# Altium project motordriver-v5.1.PrjPcb (part 3 of 3)
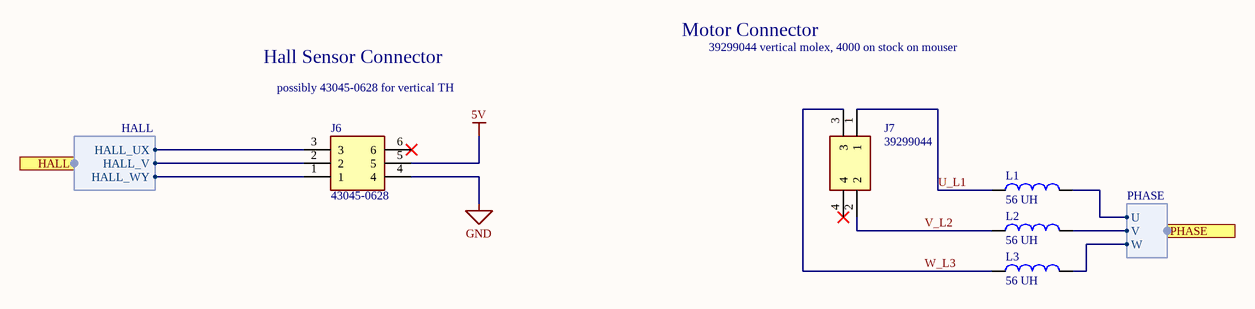
[diagram p13: connectors-dribbler.SchDoc]

## Nets that join several sheets
5V: Trinamic Controller 0 (6 pins), Connectors 0 (J4A.5), Current Amplification 0 (5 pins), power (6 pins), trinamic-controller-dribbler (6 pins), connectors-dribbler (J6.5), Current Amplification 4 (5 pins), Trinamic Controller 1 (6 pins), Connectors 1 (J4B.5), Current Amplification 1 (5 pins), Trinamic Controller 2 (6 pins), Connectors 2 (J4C.5), Current Amplification 2 (5 pins), Trinamic Controller 3 (6 pins), Connectors 3 (J4D.5), Current Amplification 3 (5 pins)
GND: Driver Power Stage 0 (5 pins), Trinamic Controller 0 (41 pins), Connectors 0 (J4A.4 J5A.4), Current Amplification 0 (10 pins), power (8 pins), ui-jetson-nano (U2.7 U3.7 U4.7), isolation (C4.1 R15.2 U5.9 U5.15), UI-JETSON-NANO/U_isolation_1 (C4A.1 U15A.9 U15A.15), UI-JETSON-NANO/U_isolation_2 (C4B.1 U15B.9 U15B.15), UI-JETSON-NANO/Demux 0 (U6A.4), UI-JETSON-NANO/Demux 1 (U6B.4), UI-JETSON-NANO/Demux 2 (U6C.4), UI-JETSON-NANO/Demux 3 (U6D.4), UI-JETSON-NANO/Demux 4 (U6E.4), UI-JETSON-NANO/U_isolation_3 (C4C.1 U15C.9 U15C.15), UI-JETSON-NANO/LP Filter 2 (C52K.1), Driver Power Stage 4 (5 pins), trinamic-controller-dribbler (36 pins), connectors-dribbler (J6.4), Current Amplification 4 (10 pins), Driver Power Stage 1 (5 pins), Trinamic Controller 1 (41 pins), Connectors 1 (J4B.4 J5B.4), Current Amplification 1 (10 pins), Driver Power Stage 2 (5 pins), Trinamic Controller 2 (41 pins), Connectors 2 (J4C.4 J5C.4), Current Amplification 2 (10 pins), Driver Power Stage 3 (5 pins), Trinamic Controller 3 (41 pins), Connectors 3 (J4D.4 J5D.4), Current Amplification 3 (10 pins)
JETSON_3V3: ui-jetson-nano (J2.14 J2.15), isolation (C3.2 U5.1), UI-JETSON-NANO/U_isolation_1 (C3A.2 U15A.1 U15A.7), UI-JETSON-NANO/U_isolation_2 (C3B.2 U15B.1 U15B.7), UI-JETSON-NANO/U_isolation_3 (C3C.2 U15C.1 U15C.7)
JETSON_GND: ui-jetson-nano (J2.13), UI-JETSON-NANO/LP Filter 0 (C52A.1), isolation (C3.1 R14.2 U5.2 U5.8), UI-JETSON-NANO/U_isolation_1 (C3A.1 U15A.2 U15A.8), UI-JETSON-NANO/U_isolation_2 (C3B.1 U15B.2 U15B.8), UI-JETSON-NANO/U_isolation_3 (C3C.1 U15C.2 U15C.8), UI-JETSON-NANO/LP Filter 1 (C52B.1), UI-JETSON-NANO/LP Filter 3 (C52C.1), UI-JETSON-NANO/LP Filter 4 (C52D.1), UI-JETSON-NANO/LP Filter 5 (C52E.1), UI-JETSON-NANO/LP Filter 6 (C52F.1), UI-JETSON-NANO/LP Filter 7 (C52G.1), UI-JETSON-NANO/LP Filter 8 (C52H.1), UI-JETSON-NANO/LP Filter 9 (C52I.1), UI-JETSON-NANO/LP Filter 10 (C52J.1), UI-JETSON-NANO/LP Filter 11 (C52L.1)
PGND: Driver Power Stage 0 (21 pins), Trinamic Controller 0 (C5A.1 R19A.2), power (6 pins), Driver Power Stage 4 (21 pins), trinamic-controller-dribbler (C32.1 R44.2), Driver Power Stage 1 (21 pins), Trinamic Controller 1 (C5B.1 R19B.2), Driver Power Stage 2 (21 pins), Trinamic Controller 2 (C5C.1 R19C.2), Driver Power Stage 3 (21 pins), Trinamic Controller 3 (C5D.1 R19D.2)
VCC: Driver Power Stage 0 (20 pins), Trinamic Controller 0 (R18A.1), power (6 pins), Driver Power Stage 4 (20 pins), trinamic-controller-dribbler (R43.1), Driver Power Stage 1 (20 pins), Trinamic Controller 1 (R18B.1), Driver Power Stage 2 (20 pins), Trinamic Controller 2 (R18C.1), Driver Power Stage 3 (20 pins), Trinamic Controller 3 (R18D.1)
VDD: Driver Power Stage 0 (C74A.1 R38A.2 U14A.16), Trinamic Controller 0 (24 pins), Connectors 0 (J5A.3), power (C2.2 R11.2 TP6.1 U1.2), ui-jetson-nano (13 pins), isolation (C4.2 U5.16), UI-JETSON-NANO/U_isolation_1 (C4A.2 U15A.10 U15A.16), UI-JETSON-NANO/U_isolation_2 (C4B.2 U15B.10 U15B.16), UI-JETSON-NANO/Demux 0 (U6A.8), UI-JETSON-NANO/Demux 1 (U6B.8), UI-JETSON-NANO/Demux 2 (U6C.8), UI-JETSON-NANO/Demux 3 (U6D.8), UI-JETSON-NANO/Demux 4 (U6E.8), UI-JETSON-NANO/U_isolation_3 (C4C.2 U15C.10 U15C.16), Driver Power Stage 4 (C74B.1 R38B.2 U14B.16), trinamic-controller-dribbler (19 pins), Driver Power Stage 1 (C74C.1 R38C.2 U14C.16), Trinamic Controller 1 (24 pins), Connectors 1 (J5B.3), Driver Power Stage 2 (C74D.1 R38D.2 U14D.16), Trinamic Controller 2 (24 pins), Connectors 2 (J5C.3), Driver Power Stage 3 (C74E.1 R38E.2 U14E.16), Trinamic Controller 3 (24 pins), Connectors 3 (J5D.3)
CS0: ui-jetson-nano (J2.2), UI-JETSON-NANO/LP Filter 3 (R77C.2)
CS0_FILTER: UI-JETSON-NANO/U_isolation_1 (U15A.4), UI-JETSON-NANO/LP Filter 3 (C52C.2 R77C.1)
CS0_ISO: UI-JETSON-NANO/U_isolation_1 (U15A.13), UI-JETSON-NANO/Demux 0 (U6A.7)
CS1: ui-jetson-nano (J2.3), UI-JETSON-NANO/LP Filter 4 (R77D.2)
CS1_FILTER: UI-JETSON-NANO/U_isolation_1 (U15A.5), UI-JETSON-NANO/LP Filter 4 (C52D.2 R77D.1)
CS1_ISO: UI-JETSON-NANO/U_isolation_1 (U15A.12), UI-JETSON-NANO/Demux 1 (U6B.7)
CS2: ui-jetson-nano (J2.4), UI-JETSON-NANO/LP Filter 5 (R77E.2)
CS2_FILTER: UI-JETSON-NANO/U_isolation_2 (U15B.3), UI-JETSON-NANO/LP Filter 5 (C52E.2 R77E.1)
CS2_ISO: UI-JETSON-NANO/U_isolation_2 (U15B.14), UI-JETSON-NANO/Demux 2 (U6C.7)
CS3: ui-jetson-nano (J2.5), UI-JETSON-NANO/LP Filter 6 (R77F.2)
CS3_FILTER: UI-JETSON-NANO/U_isolation_2 (U15B.4), UI-JETSON-NANO/LP Filter 6 (C52F.2 R77F.1)
CS3_ISO: UI-JETSON-NANO/U_isolation_2 (U15B.13), UI-JETSON-NANO/Demux 3 (U6D.7)
CS4: ui-jetson-nano (J2.6), UI-JETSON-NANO/LP Filter 7 (R77G.2)
CS4_FILTER: UI-JETSON-NANO/U_isolation_2 (U15B.5), UI-JETSON-NANO/LP Filter 7 (C52G.2 R77G.1)
CS4_ISO: UI-JETSON-NANO/U_isolation_2 (U15B.12), UI-JETSON-NANO/Demux 4 (U6E.7)
CTRL_~{CS}: Trinamic Controller 0 (U7A.6), ui-jetson-nano (R1.2 U2.1), UI-JETSON-NANO/Demux 0 (U6A.1)
CTRL_~{CS}: ui-jetson-nano (R3.2 U2.10), UI-JETSON-NANO/Demux 1 (U6B.1), Trinamic Controller 1 (U7B.6)
CTRL_~{CS}: ui-jetson-nano (R5.2 U3.1), UI-JETSON-NANO/Demux 2 (U6C.1), Trinamic Controller 2 (U7C.6)
CTRL_~{CS}: ui-jetson-nano (R7.2 U3.10), UI-JETSON-NANO/Demux 3 (U6D.1), Trinamic Controller 3 (U7D.6)
CTRL_~{CS}E: ui-jetson-nano (R9.2 U4.1), UI-JETSON-NANO/Demux 4 (U6E.1), trinamic-controller-dribbler (U10.6)
CTRL_EN: ui-jetson-nano (J2.11), UI-JETSON-NANO/LP Filter 10 (R77J.2)
CTRL_EN_FILTER: UI-JETSON-NANO/U_isolation_3 (U15C.3), UI-JETSON-NANO/LP Filter 10 (C52J.2 R77J.1)
CTRL_EN_ISO: Trinamic Controller 0 (U7A.55), UI-JETSON-NANO/U_isolation_3 (U15C.14), trinamic-controller-dribbler (U10.55), Trinamic Controller 1 (U7B.55), Trinamic Controller 2 (U7C.55), Trinamic Controller 3 (U7D.55)
CUR_U_N: Trinamic Controller 0 (U7A.17), Current Amplification 0 (NT8A.1)
CUR_U_N: trinamic-controller-dribbler (U10.17), Current Amplification 4 (NT8B.1)
CUR_U_N: Trinamic Controller 1 (U7B.17), Current Amplification 1 (NT8C.1)
CUR_U_N: Trinamic Controller 2 (U7C.17), Current Amplification 2 (NT8D.1)
CUR_U_N: Trinamic Controller 3 (U7D.17), Current Amplification 3 (NT8E.1)
CUR_U_P: Trinamic Controller 0 (TP11A.1 U7A.16), Current Amplification 0 (C53A.2 R55A.2)
CUR_U_P: trinamic-controller-dribbler (TP20.1 U10.16), Current Amplification 4 (C53B.2 R55B.2)
CUR_U_P: Trinamic Controller 1 (TP11B.1 U7B.16), Current Amplification 1 (C53C.2 R55C.2)
CUR_U_P: Trinamic Controller 2 (TP11C.1 U7C.16), Current Amplification 2 (C53D.2 R55D.2)
CUR_U_P: Trinamic Controller 3 (TP11D.1 U7D.16), Current Amplification 3 (C53E.2 R55E.2)
CUR_W_N: Trinamic Controller 0 (U7A.19), Current Amplification 0 (NT9A.1)
CUR_W_N: trinamic-controller-dribbler (U10.19), Current Amplification 4 (NT9B.1)
CUR_W_N: Trinamic Controller 1 (U7B.19), Current Amplification 1 (NT9C.1)
CUR_W_N: Trinamic Controller 2 (U7C.19), Current Amplification 2 (NT9D.1)
CUR_W_N: Trinamic Controller 3 (U7D.19), Current Amplification 3 (NT9E.1)
CUR_W_P: Trinamic Controller 0 (TP12A.1 U7A.18), Current Amplification 0 (C56A.2 R56A.2)
CUR_W_P: trinamic-controller-dribbler (TP21.1 U10.18), Current Amplification 4 (C56B.2 R56B.2)
CUR_W_P: Trinamic Controller 1 (TP12B.1 U7B.18), Current Amplification 1 (C56C.2 R56C.2)
CUR_W_P: Trinamic Controller 2 (TP12C.1 U7C.18), Current Amplification 2 (C56D.2 R56D.2)
CUR_W_P: Trinamic Controller 3 (TP12D.1 U7D.18), Current Amplification 3 (C56E.2 R56E.2)
DBGSPI.DBGSPI_MISO: Trinamic Controller 0 (U7A.4), ui-jetson-nano (TP4.1)
DBGSPI.DBGSPI_MOSI: Trinamic Controller 0 (U7A.1), ui-jetson-nano (TP3.1)
DBGSPI.DBGSPI_SCK: Trinamic Controller 0 (U7A.76), ui-jetson-nano (TP2.1)
DBGSPI.DBGSPI_TRG: Trinamic Controller 0 (U7A.5), ui-jetson-nano (TP5.1)
DBGSPI.~DBGSPI_CS: Trinamic Controller 0 (U7A.75), ui-jetson-nano (TP1.1)
DRV_~{CS}: Driver Power Stage 0 (U14A.10), ui-jetson-nano (R2.2 U2.4), UI-JETSON-NANO/Demux 0 (U6A.2)
DRV_~{CS}: ui-jetson-nano (R4.2 U2.13), UI-JETSON-NANO/Demux 1 (U6B.2), Driver Power Stage 1 (U14C.10)
DRV_~{CS}: ui-jetson-nano (R6.2 U3.4), UI-JETSON-NANO/Demux 2 (U6C.2), Driver Power Stage 2 (U14D.10)
DRV_~{CS}: ui-jetson-nano (R8.2 U3.13), UI-JETSON-NANO/Demux 3 (U6D.2), Driver Power Stage 3 (U14E.10)
DRV_~{CS}: ui-jetson-nano (R10.2 U4.4), UI-JETSON-NANO/Demux 4 (U6E.2), Driver Power Stage 4 (U14B.10)
DRV_EN: Driver Power Stage 0 (U14A.24), Trinamic Controller 0 (U7A.32)
DRV_EN: Driver Power Stage 4 (U14B.24), trinamic-controller-dribbler (U10.32)
DRV_EN: Driver Power Stage 1 (U14C.24), Trinamic Controller 1 (U7B.32)
DRV_EN: Driver Power Stage 2 (U14D.24), Trinamic Controller 2 (U7C.32)
DRV_EN: Driver Power Stage 3 (U14E.24), Trinamic Controller 3 (U7D.32)
ENC_A: Trinamic Controller 0 (R32A.2 R35A.1), Connectors 0 (J5A.1)
ENC_A: Trinamic Controller 1 (R32B.2 R35B.1), Connectors 1 (J5B.1)
ENC_A: Trinamic Controller 2 (R32C.2 R35C.1), Connectors 2 (J5C.1)
ENC_A: Trinamic Controller 3 (R32D.2 R35D.1), Connectors 3 (J5D.1)
ENC_B: Trinamic Controller 0 (R33A.2 R36A.1), Connectors 0 (J5A.2)
ENC_B: Trinamic Controller 1 (R33B.2 R36B.1), Connectors 1 (J5B.2)
ENC_B: Trinamic Controller 2 (R33C.2 R36C.1), Connectors 2 (J5C.2)
ENC_B: Trinamic Controller 3 (R33D.2 R36D.1), Connectors 3 (J5D.2)
ENC_N: Trinamic Controller 0 (R34A.2 R37A.1), Connectors 0 (J5A.5)
ENC_N: Trinamic Controller 1 (R34B.2 R37B.1), Connectors 1 (J5B.5)
ENC_N: Trinamic Controller 2 (R34C.2 R37C.1), Connectors 2 (J5C.5)
ENC_N: Trinamic Controller 3 (R34D.2 R37D.1), Connectors 3 (J5D.5)
FAULT: Driver Power Stage 0 (R78A.1 U14A.23), Trinamic Controller 0 (U7A.70)
FAULT: Driver Power Stage 4 (R78B.1 U14B.23), trinamic-controller-dribbler (U10.70)
FAULT: Driver Power Stage 1 (R78C.1 U14C.23), Trinamic Controller 1 (U7B.70)
FAULT: Driver Power Stage 2 (R78D.1 U14D.23), Trinamic Controller 2 (U7C.70)
FAULT: Driver Power Stage 3 (R78E.1 U14E.23), Trinamic Controller 3 (U7D.70)
HALL_UX: Trinamic Controller 0 (R26A.2 R29A.1), Connectors 0 (J4A.3)
HALL_UX: Trinamic Controller 1 (R26B.2 R29B.1), Connectors 1 (J4B.3)
HALL_UX: Trinamic Controller 2 (R26C.2 R29C.1), Connectors 2 (J4C.3)
HALL_UX: Trinamic Controller 3 (R26D.2 R29D.1), Connectors 3 (J4D.3)
HALL_UXE: trinamic-controller-dribbler (R47.2 R50.1), connectors-dribbler (J6.3)
HALL_V: Trinamic Controller 0 (R27A.2 R30A.1), Connectors 0 (J4A.2)
HALL_V: Trinamic Controller 1 (R27B.2 R30B.1), Connectors 1 (J4B.2)
HALL_V: Trinamic Controller 2 (R27C.2 R30C.1), Connectors 2 (J4C.2)
HALL_V: Trinamic Controller 3 (R27D.2 R30D.1), Connectors 3 (J4D.2)
HALL_VE: trinamic-controller-dribbler (R48.2 R51.1), connectors-dribbler (J6.2)
HALL_WY: Trinamic Controller 0 (R28A.2 R31A.1), Connectors 0 (J4A.1)
HALL_WY: Trinamic Controller 1 (R28B.2 R31B.1), Connectors 1 (J4B.1)
HALL_WY: Trinamic Controller 2 (R28C.2 R31C.1), Connectors 2 (J4C.1)
HALL_WY: Trinamic Controller 3 (R28D.2 R31D.1), Connectors 3 (J4D.1)
HALL_WYE: trinamic-controller-dribbler (R49.2 R52.1), connectors-dribbler (J6.1)
MISO: ui-jetson-nano (J2.9), isolation (U5.6)
MISO_CTRL0: Trinamic Controller 0 (U7A.9), ui-jetson-nano (U2.2)
MISO_CTRL1: ui-jetson-nano (U2.9), Trinamic Controller 1 (U7B.9)
MISO_CTRL2: ui-jetson-nano (U3.2), Trinamic Controller 2 (U7C.9)
MISO_CTRL3: ui-jetson-nano (U3.9), Trinamic Controller 3 (U7D.9)
MISO_CTRL4: ui-jetson-nano (U4.2), trinamic-controller-dribbler (U10.9)
MISO_DRV0: Driver Power Stage 0 (U14A.13), ui-jetson-nano (U2.5)
MISO_DRV1: ui-jetson-nano (U2.12), Driver Power Stage 1 (U14C.13)
MISO_DRV2: ui-jetson-nano (U3.5), Driver Power Stage 2 (U14D.13)
MISO_DRV3: ui-jetson-nano (U3.12), Driver Power Stage 3 (U14E.13)
MISO_DRV4: ui-jetson-nano (U4.5), Driver Power Stage 4 (U14B.13)
MISO_FILTER: isolation (U5.11), UI-JETSON-NANO/LP Filter 2 (C52K.2 R77K.1)
MISO_ISO: Connectors 0 (J8A.3), ui-jetson-nano (10 pins), UI-JETSON-NANO/LP Filter 2 (R77K.2), Connectors 1 (J8B.3), Connectors 2 (J8C.3), Connectors 3 (J8D.3)
MOSI: ui-jetson-nano (J2.10), UI-JETSON-NANO/LP Filter 1 (R77B.2)
MOSI_FILTER: isolation (U5.5), UI-JETSON-NANO/LP Filter 1 (C52B.2 R77B.1)
MOSI_ISO: Driver Power Stage 0 (U14A.12), Trinamic Controller 0 (U7A.8), Connectors 0 (J8A.4), isolation (U5.12), Driver Power Stage 4 (U14B.12), trinamic-controller-dribbler (U10.8), Driver Power Stage 1 (U14C.12), Trinamic Controller 1 (U7B.8), Connectors 1 (J8B.4), Driver Power Stage 2 (U14D.12), Trinamic Controller 2 (U7C.8), Connectors 2 (J8C.4), Driver Power Stage 3 (U14E.12), Trinamic Controller 3 (U7D.8), Connectors 3 (J8D.4)
MUX_SEL_0: ui-jetson-nano (J2.1), UI-JETSON-NANO/LP Filter 8 (R77H.2)
MUX_SEL_1: ui-jetson-nano (J2.7), UI-JETSON-NANO/LP Filter 9 (R77I.2)
MUX_SEL_FILTER_0: UI-JETSON-NANO/U_isolation_1 (U15A.3), UI-JETSON-NANO/LP Filter 8 (C52H.2 R77H.1)
MUX_SEL_FILTER_1: isolation (U5.3), UI-JETSON-NANO/LP Filter 9 (C52I.2 R77I.1)
MUX_SEL_ISO_0: UI-JETSON-NANO/U_isolation_1 (U15A.14), UI-JETSON-NANO/Demux 0 (U6A.6), UI-JETSON-NANO/Demux 1 (U6B.6), UI-JETSON-NANO/Demux 2 (U6C.6), UI-JETSON-NANO/Demux 3 (U6D.6), UI-JETSON-NANO/Demux 4 (U6E.6)
MUX_SEL_ISO_1: isolation (U5.14), UI-JETSON-NANO/Demux 0 (U6A.5), UI-JETSON-NANO/Demux 1 (U6B.5), UI-JETSON-NANO/Demux 2 (U6C.5), UI-JETSON-NANO/Demux 3 (U6D.5), UI-JETSON-NANO/Demux 4 (U6E.5)
SCK: ui-jetson-nano (J2.8), UI-JETSON-NANO/LP Filter 0 (R77A.2)
SCK_FILTER: UI-JETSON-NANO/LP Filter 0 (C52A.2 R77A.1), isolation (U5.4)
SCK_ISO: Driver Power Stage 0 (U14A.11), Trinamic Controller 0 (U7A.7), Connectors 0 (J8A.2), isolation (U5.13), Driver Power Stage 4 (U14B.11), trinamic-controller-dribbler (U10.7), Driver Power Stage 1 (U14C.11), Trinamic Controller 1 (U7B.7), Connectors 1 (J8B.2), Driver Power Stage 2 (U14D.11), Trinamic Controller 2 (U7C.7), Connectors 2 (J8C.2), Driver Power Stage 3 (U14E.11), Trinamic Controller 3 (U7D.7), Connectors 3 (J8D.2)
U: Driver Power Stage 0 (NT3A.2 R60A.1 TP13A.1), Connectors 0 (J3A.1)
U: Driver Power Stage 4 (NT3B.2 R60B.1 TP13B.1), connectors-dribbler (L1.2)
U: Driver Power Stage 1 (NT3C.2 R60C.1 TP13C.1), Connectors 1 (J3B.1)
U: Driver Power Stage 2 (NT3D.2 R60D.1 TP13D.1), Connectors 2 (J3C.1)
U: Driver Power Stage 3 (NT3E.2 R60E.1 TP13E.1), Connectors 3 (J3D.1)
U_SENSE_N: Driver Power Stage 0 (NT3A.1), Current Amplification 0 (U12A.5)
U_SENSE_N: Driver Power Stage 4 (NT3B.1), Current Amplification 4 (U12B.5)
U_SENSE_N: Driver Power Stage 1 (NT3C.1), Current Amplification 1 (U12C.5)
U_SENSE_N: Driver Power Stage 2 (NT3D.1), Current Amplification 2 (U12D.5)
U_SENSE_N: Driver Power Stage 3 (NT3E.1), Current Amplification 3 (U12E.5)
U_SENSE_P: Driver Power Stage 0 (NT2A.1), Current Amplification 0 (U12A.4)
U_SENSE_P: Driver Power Stage 4 (NT2B.1), Current Amplification 4 (U12B.4)
U_SENSE_P: Driver Power Stage 1 (NT2C.1), Current Amplification 1 (U12C.4)
U_SENSE_P: Driver Power Stage 2 (NT2D.1), Current Amplification 2 (U12D.4)
U_SENSE_P: Driver Power Stage 3 (NT2E.1), Current Amplification 3 (U12E.4)
UH: Driver Power Stage 0 (U14A.14), Trinamic Controller 0 (U7A.39)
UH: Driver Power Stage 4 (U14B.14), trinamic-controller-dribbler (U10.39)
UH: Driver Power Stage 1 (U14C.14), Trinamic Controller 1 (U7B.39)
UH: Driver Power Stage 2 (U14D.14), Trinamic Controller 2 (U7C.39)
UH: Driver Power Stage 3 (U14E.14), Trinamic Controller 3 (U7D.39)
UL: Driver Power Stage 0 (U14A.15), Trinamic Controller 0 (U7A.40)
UL: Driver Power Stage 4 (U14B.15), trinamic-controller-dribbler (U10.40)
UL: Driver Power Stage 1 (U14C.15), Trinamic Controller 1 (U7B.40)
UL: Driver Power Stage 2 (U14D.15), Trinamic Controller 2 (U7C.40)
UL: Driver Power Stage 3 (U14E.15), Trinamic Controller 3 (U7D.40)
V: Driver Power Stage 0 (R66A.1 TP15A.1), Connectors 0 (J3A.2)
V: Driver Power Stage 4 (R66B.1 TP15B.1), connectors-dribbler (L2.2)
V: Driver Power Stage 1 (R66C.1 TP15C.1), Connectors 1 (J3B.2)
V: Driver Power Stage 2 (R66D.1 TP15D.1), Connectors 2 (J3C.2)
V: Driver Power Stage 3 (R66E.1 TP15E.1), Connectors 3 (J3D.2)
VH: Driver Power Stage 0 (U14A.17), Trinamic Controller 0 (U7A.41)
VH: Driver Power Stage 4 (U14B.17), trinamic-controller-dribbler (U10.41)
VH: Driver Power Stage 1 (U14C.17), Trinamic Controller 1 (U7B.41)
VH: Driver Power Stage 2 (U14D.17), Trinamic Controller 2 (U7C.41)
VH: Driver Power Stage 3 (U14E.17), Trinamic Controller 3 (U7D.41)
VL: Driver Power Stage 0 (U14A.18), Trinamic Controller 0 (U7A.42)
VL: Driver Power Stage 4 (U14B.18), trinamic-controller-dribbler (U10.42)
VL: Driver Power Stage 1 (U14C.18), Trinamic Controller 1 (U7B.42)
VL: Driver Power Stage 2 (U14D.18), Trinamic Controller 2 (U7C.42)
VL: Driver Power Stage 3 (U14E.18), Trinamic Controller 3 (U7D.42)
W: Driver Power Stage 0 (NT6A.2 R74A.1 TP17A.1), Connectors 0 (J3A.3)
W: Driver Power Stage 4 (NT6B.2 R74B.1 TP17B.1), connectors-dribbler (L3.2)
W: Driver Power Stage 1 (NT6C.2 R74C.1 TP17C.1), Connectors 1 (J3B.3)
W: Driver Power Stage 2 (NT6D.2 R74D.1 TP17D.1), Connectors 2 (J3C.3)
W: Driver Power Stage 3 (NT6E.2 R74E.1 TP17E.1), Connectors 3 (J3D.3)
W_SENSE_N: Driver Power Stage 0 (NT6A.1), Current Amplification 0 (U13A.5)
W_SENSE_N: Driver Power Stage 4 (NT6B.1), Current Amplification 4 (U13B.5)
W_SENSE_N: Driver Power Stage 1 (NT6C.1), Current Amplification 1 (U13C.5)
W_SENSE_N: Driver Power Stage 2 (NT6D.1), Current Amplification 2 (U13D.5)
W_SENSE_N: Driver Power Stage 3 (NT6E.1), Current Amplification 3 (U13E.5)
W_SENSE_P: Driver Power Stage 0 (NT7A.1), Current Amplification 0 (U13A.4)
W_SENSE_P: Driver Power Stage 4 (NT7B.1), Current Amplification 4 (U13B.4)
W_SENSE_P: Driver Power Stage 1 (NT7C.1), Current Amplification 1 (U13C.4)
W_SENSE_P: Driver Power Stage 2 (NT7D.1), Current Amplification 2 (U13D.4)
W_SENSE_P: Driver Power Stage 3 (NT7E.1), Current Amplification 3 (U13E.4)
WH: Driver Power Stage 0 (U14A.19), Trinamic Controller 0 (U7A.46)
WH: Driver Power Stage 4 (U14B.19), trinamic-controller-dribbler (U10.46)
WH: Driver Power Stage 1 (U14C.19), Trinamic Controller 1 (U7B.46)
WH: Driver Power Stage 2 (U14D.19), Trinamic Controller 2 (U7C.46)
WH: Driver Power Stage 3 (U14E.19), Trinamic Controller 3 (U7D.46)
WL: Driver Power Stage 0 (U14A.20), Trinamic Controller 0 (U7A.47)
WL: Driver Power Stage 4 (U14B.20), trinamic-controller-dribbler (U10.47)
WL: Driver Power Stage 1 (U14C.20), Trinamic Controller 1 (U7B.47)
WL: Driver Power Stage 2 (U14D.20), Trinamic Controller 2 (U7C.47)
WL: Driver Power Stage 3 (U14E.20), Trinamic Controller 3 (U7D.47)
~RST: ui-jetson-nano (J2.12), UI-JETSON-NANO/LP Filter 11 (R77L.2)
~RST_FILTER: UI-JETSON-NANO/U_isolation_3 (U15C.4), UI-JETSON-NANO/LP Filter 11 (C52L.2 R77L.1)
~RST_ISO: Trinamic Controller 0 (U7A.50), UI-JETSON-NANO/U_isolation_3 (U15C.13), trinamic-controller-dribbler (U10.50), Trinamic Controller 1 (U7B.50), Trinamic Controller 2 (U7C.50), Trinamic Controller 3 (U7D.50)